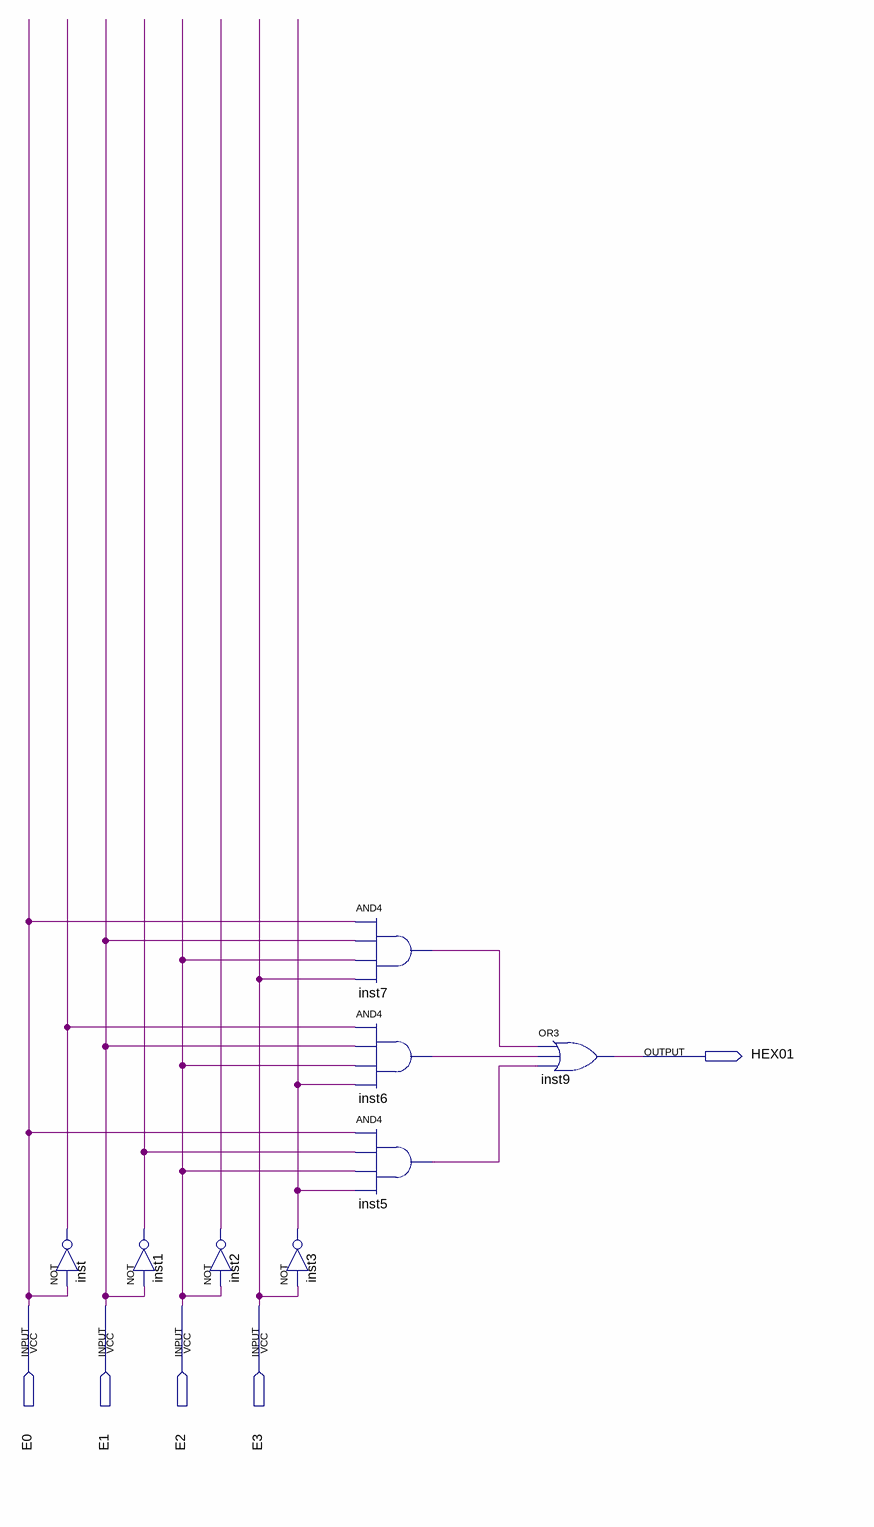
[diagram p0: schematic sheet]
// Quartus schematic HEX_01_4BITS.bdf as structural Verilog: 8 symbols, 5 pins
module HEX_01_4BITS (
  input  E0,
  input  E1,
  input  E2,
  input  E3,
  output HEX01
);

  wire inst1_out, inst2_out, inst3_out, inst5_out, inst6_out, inst7_out, inst_out;

  not inst (inst_out, E0);
  not inst1 (inst1_out, E1);
  not inst2 (inst2_out, E2);
  not inst3 (inst3_out, E3);
  and inst7 (inst7_out, E0, E1, E2, E3);
  and inst6 (inst6_out, inst_out, E1, E2, inst3_out);
  and inst5 (inst5_out, E0, inst1_out, E2, inst3_out);
  or inst9 (HEX01, inst7_out, inst6_out, inst5_out);
endmodule
